# Altium schematic sheet Sensor_SHT10.SchDoc
size 88 x 55 mm
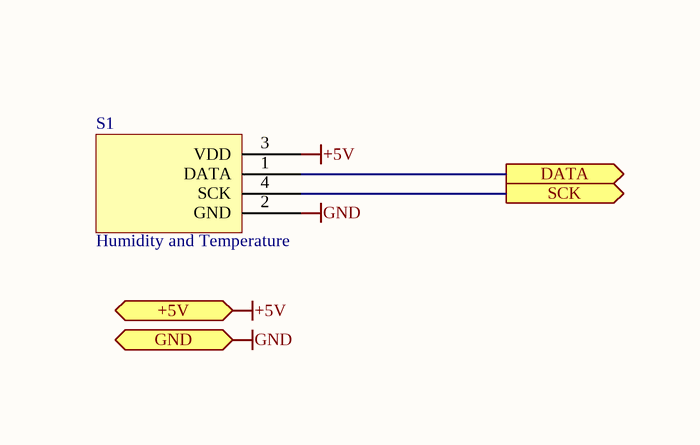
[diagram p0: Sensor_SHT10.SchDoc]

## Parts
S1  Humidity and Temperature  [SHT1x_1]

## Ports
+5V (in), DATA (out), GND (in), SCK (out)

## Nets
+5V: S1.3(VDD) ; port +5V
GND: S1.2(GND) ; port GND
DATA: S1.1(DATA) ; port DATA
SCK: S1.4(SCK) ; port SCK

## Library data of the parts
S1 = SHT1x